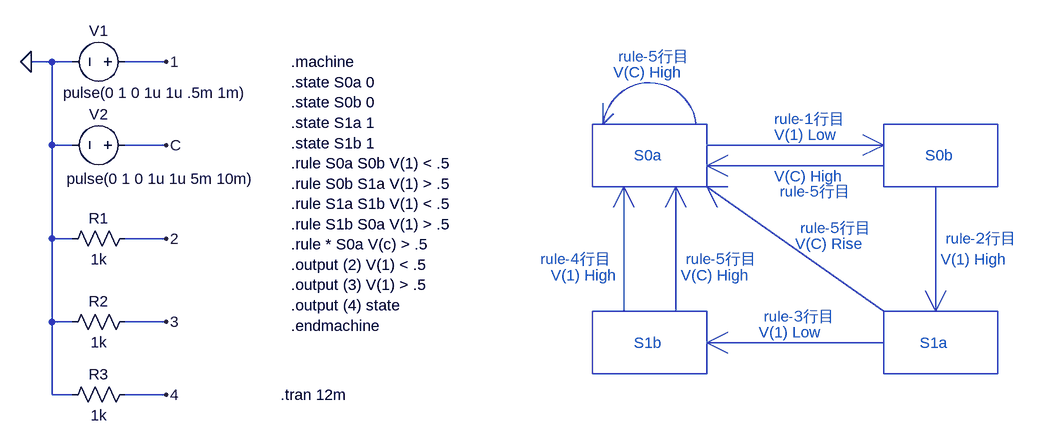
[diagram p0: schematic Fig_3-54_StateMachine2.asc]
Fig_3-54_StateMachine2.asc, the LTspice schematic file:
Version 4
SHEET 1 1332 680
WIRE -176 -432 -208 -432
WIRE -144 -432 -176 -432
WIRE 0 -432 -64 -432
WIRE -176 -304 -176 -432
WIRE -144 -304 -176 -304
WIRE 0 -304 -64 -304
WIRE -176 -160 -176 -304
WIRE -144 -160 -176 -160
WIRE 0 -160 -64 -160
WIRE -176 -32 -176 -160
WIRE -144 -32 -176 -32
WIRE 0 -32 -64 -32
WIRE -176 80 -176 -32
WIRE -144 80 -176 80
WIRE 0 80 -64 80
FLAG -208 -432 0
FLAG 0 -432 1
FLAG 0 -304 C
FLAG 0 -160 2
FLAG 0 -32 3
FLAG 0 80 4
SYMBOL voltage -48 -432 R90
WINDOW 0 -32 56 VBottom 2
WINDOW 3 32 -31 VTop 2
SYMATTR InstName V1
SYMATTR Value pulse(0 1 0 1u 1u .5m 1m)
SYMBOL voltage -48 -304 R90
WINDOW 0 -32 56 VBottom 2
WINDOW 3 36 -40 VTop 2
SYMATTR InstName V2
SYMATTR Value pulse(0 1 0 1u 1u 5m 10m)
SYMBOL res -48 -176 R90
WINDOW 0 0 56 VBottom 2
WINDOW 3 32 56 VTop 2
SYMATTR InstName R1
SYMATTR Value 1k
SYMBOL res -48 -48 R90
WINDOW 0 0 56 VBottom 2
WINDOW 3 32 56 VTop 2
SYMATTR InstName R2
SYMATTR Value 1k
SYMBOL res -48 64 R90
WINDOW 0 0 56 VBottom 2
WINDOW 3 32 56 VTop 2
SYMATTR InstName R3
SYMATTR Value 1k
TEXT 192 -432 Left 2 !.machine \n.state S0a 0 \n.state S0b 0\n.state S1a 1 \n.state S1b 1 \n.rule S0a S0b V(1) < .5 \n.rule S0b S1a V(1) > .5 \n.rule S1a S1b V(1) < .5 \n.rule S1b S0a V(1) > .5 \n.rule * S0a V(c) > .5 \n.output (2) V(1) < .5 \n.output (3) V(1) > .5 \n.output (4) state \n.endmachine
TEXT 176 80 Left 2 !.tran 12m
TEXT 720 -288 Left 2 ;S0a
TEXT 1168 -288 Left 2 ;S0b
TEXT 720 0 Left 2 ;S1b
TEXT 1160 0 Left 2 ;S1a
TEXT 936 -320 Left 2 ;V(1) Low
TEXT 912 -16 Left 2 ;V(1) Low
TEXT 1192 -128 Left 2 ;V(1) High
TEXT 592 -104 Left 2 ;V(1) High
TEXT 936 -256 Left 2 ;V(C) High
TEXT 792 -104 Left 2 ;V(C) High
TEXT 968 -152 Left 2 ;V(C) Rise
TEXT 688 -416 Left 2 ;V(C) High
TEXT 936 -344 Left 2 ;rule-1行目
TEXT 1200 -160 Left 2 ;rule-2行目
TEXT 920 -40 Left 2 ;rule-3行目
TEXT 576 -128 Left 2 ;rule-4行目
TEXT 696 -440 Left 2 ;rule-5行目
TEXT 944 -232 Left 2 ;rule-5行目
TEXT 976 -176 Left 2 ;rule-5行目
TEXT 800 -128 Left 2 ;rule-5行目
LINE Normal 1104 -304 832 -304
LINE Normal 1104 -304 1072 -320
LINE Normal 1072 -288 1104 -304
LINE Normal 1184 -48 1184 -240
LINE Normal 832 0 1104 0
LINE Normal 704 -240 704 -48
LINE Normal 704 -240 688 -208
LINE Normal 720 -208 704 -240
LINE Normal 1184 -48 1168 -80
LINE Normal 1200 -80 1184 -48
LINE Normal 832 0 864 -16
LINE Normal 864 16 832 0
LINE Normal 832 -272 1104 -272
LINE Normal 832 -272 864 -288
LINE Normal 864 -256 832 -272
LINE Normal 784 -240 784 -48
LINE Normal 784 -240 768 -208
LINE Normal 800 -208 784 -240
LINE Normal 832 -240 1104 -48
LINE Normal 848 -208 832 -240
LINE Normal 864 -240 832 -240
LINE Normal 672 -368 672 -336
LINE Normal 688 -352 672 -336
RECTANGLE Normal 832 -336 656 -240
RECTANGLE Normal 1280 -336 1104 -240
RECTANGLE Normal 1280 -48 1104 48
RECTANGLE Normal 832 -48 656 48
ARC Normal 672 -256 816 -400 816 -338 674 -339

The netlist it stands for:
* Fig_3-54_StateMachine2.asc
V1 1 0 pulse(0 1 0 1u 1u .5m 1m)
V2 C 0 pulse(0 1 0 1u 1u 5m 10m)
R1 2 0 1k
R2 3 0 1k
R3 4 0 1k
.machine
.state S0a 0
.state S0b 0
.state S1a 1
.state S1b 1
.rule S0a S0b V(1) < .5
.rule S0b S1a V(1) > .5
.rule S1a S1b V(1) < .5
.rule S1b S0a V(1) > .5
.rule * S0a V(c) > .5
.output (2) V(1) < .5
.output (3) V(1) > .5
.output (4) state
.endmachine
.tran 12m
* S0a
* S0b
* S1b
* S1a
* V(1) Low
* V(1) Low
* V(1) High
* V(1) High
* V(C) High
* V(C) High
* V(C) Rise
* V(C) High
* rule-1行目
* rule-2行目
* rule-3行目
* rule-4行目
* rule-5行目
* rule-5行目
* rule-5行目
* rule-5行目
.backanno
.end